# EAGLE design p7ii-001 (EAGLE 9.6.2)
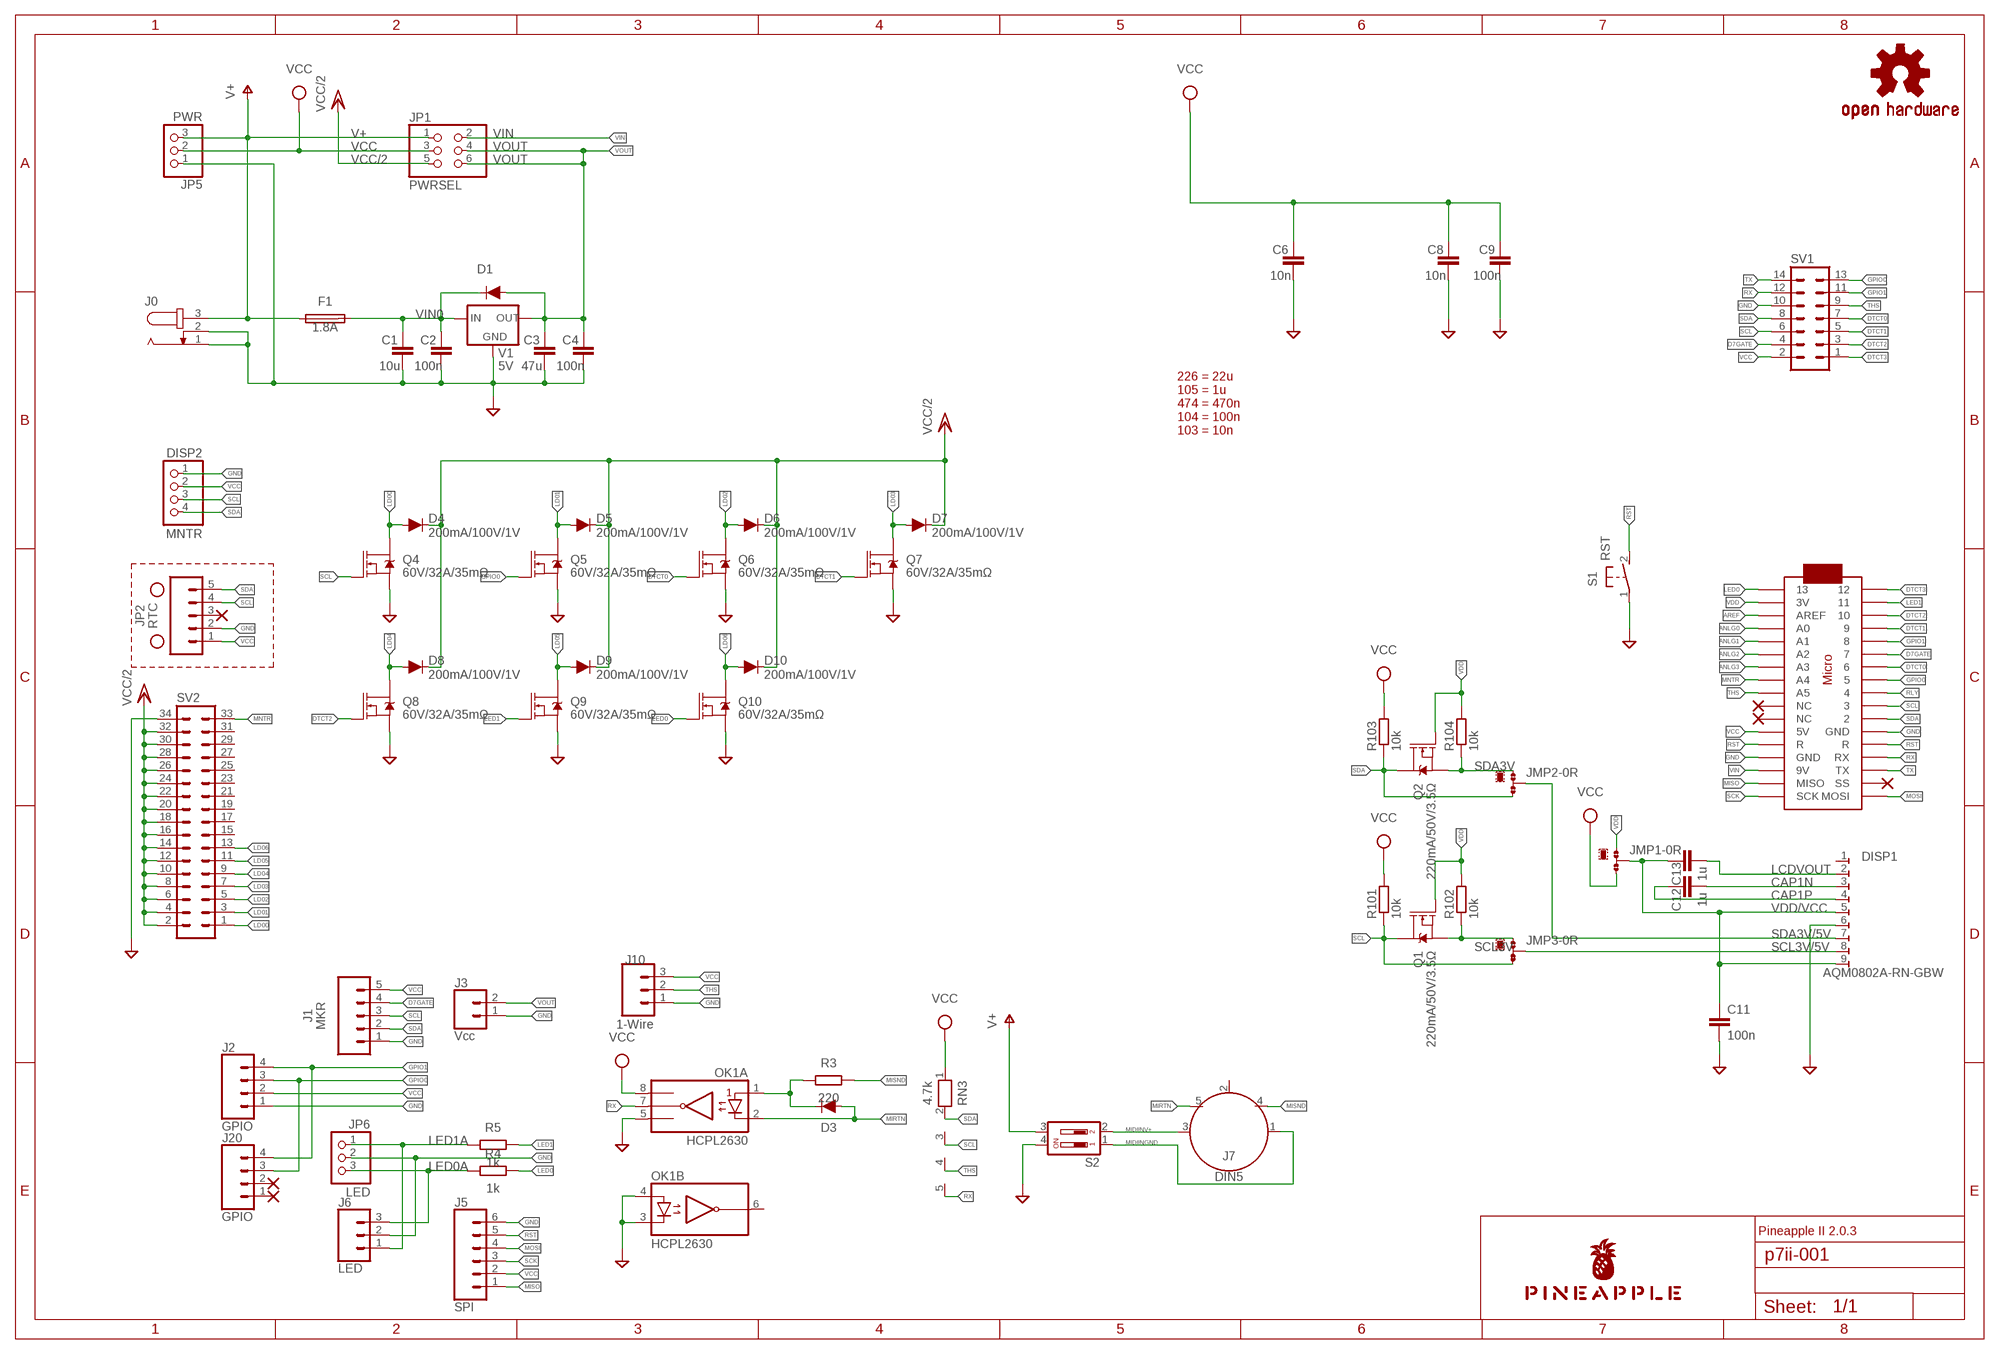
[diagram p0: schematic, sheet 1]

## Parts
C1  10u  C-EU025-030X050  [C025-030X050]
C2  100n  C-EU025-024X044  [C025-024X044]
C3  47u  C-EU025-050X050  [C025-050X050]
C4  100n  C-EU025-024X044  [C025-024X044]
C6  10n  C-EU025-024X044  [C025-024X044]
C8  10n  C-EU025-024X044  [C025-024X044]
C9  100n  C-EU025-024X044  [C025-024X044]
C11  100n  C-EU025-024X044  [C025-024X044]
C12  1u  C-EU050-024X044  [C050-024X044]
C13  1u  C-EU050-024X044  [C050-024X044]
D1  DIODE-1N4148  [DIODE-1N4148]
D3  DIODE-1N4148  [DIODE-1N4148]
D4  200mA/100V/1V  DIODE-1N4148  [DIODE-1N4148]
D5  200mA/100V/1V  DIODE-1N4148  [DIODE-1N4148]
D6  200mA/100V/1V  DIODE-1N4148  [DIODE-1N4148]
D7  200mA/100V/1V  DIODE-1N4148  [DIODE-1N4148]
D8  200mA/100V/1V  DIODE-1N4148  [DIODE-1N4148]
D9  200mA/100V/1V  DIODE-1N4148  [DIODE-1N4148]
D10  200mA/100V/1V  DIODE-1N4148  [DIODE-1N4148]
DISP1  AQM0802A-RN-GBW  [AQM0802A-RN-GBW-FOOTPRINT]
DISP2  MNTR  PINHD-1X4  [1X04]
F1  1.8A  TE5  [TE5]
H1  STAND-OFF  [STAND-OFF]
H2  STAND-OFF  [STAND-OFF]
J0  JACK-PLUG0  [SPC4077]
J1  MKR  CONN_05JST  [JST-5-PTH]
J2  GPIO  CONN_04JST-PTH  [JST-4-PTH]
J3  Vcc  CONN_02JST-PTH-2  [JST-2-PTH]
J5  SPI  CONN_061.27MM  [1X06_1.27MM]
J6  LED  CONN_03JST-PTH-VERT  [JST-3-PTH-VERT]
J7  DIN5  [DIN5-RA-PTH]
J10  1-Wire  CONN_03JST-PTH-VERT  [JST-3-PTH-VERT]
J20  GPIO  CONN_041.27MM  [1X04_1.27MM]
JMP1  0R-JUMPA  [A0R-JMP]
JMP2  0R-JUMPA  [A0R-JMP]
JMP3  0R-JUMPA  [A0R-JMP]
JP1  PWRSEL  PINHD-2X3  [2X03]
JP2  RTC  CONN_05  [1X05]
JP5  PWR  PINHD-1X3  [1X03]
JP6  LED  PINHD-1X3  [1X03]
LOGO1  OSHW-LOGOS-COPPER  [OSHW-LOGO-S_COPPER]
MC1  ARDUINOMICRO  [ARDUINOMICRO]
OK1  HCPL2630  [DIL08]
Q1  220mA/50V/3.5Ω  MOSFET-NCH-BSS138  [SOT23-3]
Q2  220mA/50V/3.5Ω  MOSFET-NCH-BSS138  [SOT23-3]
Q4  60V/32A/35mΩ  MOSFET-NCH-FQP30N06L  [TO220V]
Q5  60V/32A/35mΩ  MOSFET-NCH-FQP30N06L  [TO220V]
Q6  60V/32A/35mΩ  MOSFET-NCH-FQP30N06L  [TO220V]
Q7  60V/32A/35mΩ  MOSFET-NCH-FQP30N06L  [TO220V]
Q8  60V/32A/35mΩ  MOSFET-NCH-FQP30N06L  [TO220V]
Q9  60V/32A/35mΩ  MOSFET-NCH-FQP30N06L  [TO220V]
Q10  60V/32A/35mΩ  MOSFET-NCH-FQP30N06L  [TO220V]
R3  220  R-EU_0204/5  [0204/5]
R4  1k  R-EU_0204/5  [0204/5]
R5  1k  R-EU_0204/5  [0204/5]
R101  10k  R-EU_M2012  [M2012]
R102  10k  R-EU_M2012  [M2012]
R103  10k  R-EU_M2012  [M2012]
R104  10k  R-EU_M2012  [M2012]
RN3  4.7k  RN04  [RN-5]
S1  RST  31-XX  [B3F-31XX]
S2  DIP02YL  [DIP02YL]
SV1  ML14  [ML14]
SV2  ML34L  [ML34L]
U$1  PINEAPPLE450_SILK  [PINEAPPLE450_SILK]
V1  5V  78XXS  [78XXS]

## Nets
ANLG0 [analog]: MC1.P$31(A0)
ANLG1 [analog]: MC1.P$30(A1)
ANLG2 [analog]: MC1.P$29(A2)
ANLG3 [analog]: MC1.P$28(A3)
AREF: MC1.P$32(AREF)
CAP1N: C12.2 DISP1.3
CAP1P: C12.1 DISP1.4
D7GATE: J1.4 MC1.P$6 SV1.4
DTCT0: MC1.P$7 Q6.1(G) SV1.7
DTCT1: MC1.P$4 Q7.1(G) SV1.5
DTCT2: MC1.P$3 Q8.1(G) SV1.3
DTCT3: MC1.P$1 SV1.1
GND [gnd]: C1.2 C2.2 C3.2 C4.2 C6.2 C8.2 C9.2 C11.2 DISP1.6 DISP2.1 J0.1 J0.2 J1.1 J2.1 J3.1 J5.6 J6.2 J10.1 JP2.2 JP5.1 JP6.2 MC1.P$12(GND) MC1.P$21(GND) OK1.3(B:C2) OK1.4(B:A2) OK1.5(A:GND) Q4.3(S) Q5.3(S) Q6.3(S) Q7.3(S) Q8.3(S) Q9.3(S) Q10.3(S) S1.1(P) S2.4 SV1.10 SV2.34 V1.GND
GPIO0: J2.3 J20.3 MC1.P$8 Q5.1(G) SV1.13
GPIO1: J2.4 J20.4 MC1.P$5 SV1.11
LCDVOUT: C13.2 DISP1.2
LD00: D4.A Q4.2(D) SV2.1
LD01: D5.A Q5.2(D) SV2.3
LD02: D6.A Q6.2(D) SV2.5
LD03: D7.A Q7.2(D) SV2.7
LD04: D8.A Q8.2(D) SV2.9
LD05: D9.A Q9.2(D) SV2.11
LD06: D10.A Q10.2(D) SV2.13
LED0: MC1.P$34 Q10.1(G) R4.2
LED0A: J6.3 JP6.3 R4.1
LED1: MC1.P$2 Q9.1(G) R5.2
LED1A: J6.1 JP6.1 R5.1
MIDIINGND [gnd]: J7.1 S2.1
MIDIINSND: D3.C OK1.1(A:A1) R3.1
MIDIINV+ [power]: J7.3 S2.2
MIRTN: D3.A J7.5 OK1.2(A:C1)
MISND: J7.4 R3.2
MISO: J5.1 MC1.P$19(MISO)
MNTR: MC1.P$27(A4) SV2.33
MOSI: J5.4 MC1.P$17(MOSI)
RLY: MC1.P$9
RST: J5.5 MC1.P$13(R) MC1.P$22(R) S1.2(S)
RX: MC1.P$14(RX) OK1.7(A:VO1) RN3.5 SV1.12
SCK: J5.3 MC1.P$18(SCK)
SCL: DISP2.3 J1.3 JMP3.3 JP2.4 MC1.P$10 Q1.3(D) Q4.1(G) R101.1 RN3.3 SV1.6
SCL3V: JMP3.1 Q1.2(S) R102.1
SCL3V/5V: DISP1.8 JMP3.2
SDA: DISP2.4 J1.2 JMP2.3 JP2.5 MC1.P$11 Q2.3(D) R103.1 RN3.2 SV1.8
SDA3V: JMP2.1 Q2.2(S) R104.1
SDA3V/5V: DISP1.7 JMP2.2
THS: J10.2 MC1.P$26(A5) RN3.4 SV1.9
TX: MC1.P$15(TX) SV1.14
V+ [superpower]: F1.1 J0.3 JP1.1 JP5.3 S2.3
VCC [power]: C6.1 C8.1 C9.1 DISP2.2 J1.5 J2.2 J5.2 J10.3 JMP1.3 JP1.3 JP2.1 JP5.2 MC1.P$23(5V) OK1.8(A:VCC) R101.2 R103.2 RN3.1 SV1.2
VCC/2 [superpower]: D4.C D5.C D6.C D7.C D8.C D9.C D10.C JP1.5 SV2.2 SV2.4 SV2.6 SV2.8 SV2.10 SV2.12 SV2.14 SV2.16 SV2.18 SV2.20 SV2.22 SV2.24 SV2.26 SV2.28 SV2.30 SV2.32
VDD [power]: JMP1.1 MC1.P$33(3V) Q1.1(G) Q2.1(G) R102.2 R104.2
VDD/VCC [power]: C11.1 C13.1 DISP1.5 DISP1.9 JMP1.2
VIN [superpower]: JP1.2 MC1.P$20(9V)
VIN0 [superpower]: C1.1 C2.1 D1.C F1.2 V1.IN
VOUT [superpower]: C3.1 C4.1 D1.A J3.2 JP1.4 JP1.6 V1.OUT
Unconnected: DISP1.1 J7.2 J20.1 J20.2 JP2.3 MC1.P$16(SS) MC1.P$24(NC) MC1.P$25(NC) OK1.6(B:VO2) SV2.15 SV2.17 SV2.19 SV2.21 SV2.23 SV2.25 SV2.27 SV2.29 SV2.31

## Notes on the sheet
- 226 = 22u
  105 = 1u
  474 = 470n
  104 = 100n
  103 = 10n
- Pineapple II 2.0.3

## Library data of the parts
C1-C4 C11-C13 = rcl:C-EU: CAPACITOR, European symbol; SPICEPREFIX: C
C6 C8 C9 = resistor:C-EU: CAPACITOR, European symbol
D1 D3 = SparkFun-DiscreteSemi:DIODE: Diode These are standard reverse protection diodes and small signal diodes. SparkFun Products: SparkFun SparkPunk Sound Kit <https://www.sparkfun.com/products/11177> SparkFun ESP8266 Thing <https://www.sparkfun.com/products/13231>; PROD_ID: DIO-08378; VALUE: 200mA/100V/1V
D4-D10 = SparkFun-DiscreteSemi:DIODE: Diode These are standard reverse protection diodes and small signal diodes. SparkFun Products: SparkFun SparkPunk Sound Kit <https://www.sparkfun.com/products/11177> SparkFun ESP8266 Thing <https://www.sparkfun.com/products/13231>; PROD_ID: DIO-08378
DISP1 = AQM0802A-RN-GBW:AQM0802A-RN-GBW: AQM0802A-RN-GBW LCD
DISP2 = pinhead:PINHD-1X4: PIN HEADER
F1 = fuse:TE5: FUSE Wickmann; OC_FARNELL: unknown; OC_NEWARK: unknown
H1 H2 = SparkFun-Hardware:STAND-OFF: Stand Off Drill holes for mechanically mounting via screws, standoffs, etc. Note: Use the keepout ring to avoid running the screw head into surrounding components. Variant Overviews STAND-OFF - Mechanical footprint for a #4 phillips button head screw. STAND-OFF-TIGHT - Mechanical footprint for a #4 phillips button head screw, Example SparkFun Products Screw - Phillips Head (1/4", 4-40, 10 pack) <https://www.sparkfun.com/products/10453> (PRT-10453) Screw - Phillips Head (1/2", 4-40, 10 pack) <https://www.sparkfun.com/products/10452> (PRT-10452) Screw - Phillips Head (3/4", 4-40, 10 pack) <https://www.sparkfun.com/products/10451> (PRT-10451) Screw - Phillips Head (1", 4-40, 10 pack) <https://www.sparkfun.com/products/10450> (PRT-10450)
J0 = con-jack:JACK-PLUG: DC POWER JACK Power Jack, DC, Right Angle, Through Hole, Rated 5A at 16VDC, PC Terminals Distributor: Farnell (www.Farnell.de) Drawing: 84N1161.pdf / 84N1162.pdf Manufacturer: SPC Technology (www.spctechnology.com) Type: SPC4077 / SPC 4078; OC_FARNELL: unknown; OC_NEWARK: unknown
J1 = SparkFun-Connectors:CONN_05: Multi connection point. Often used as Generic Header-pin footprint for 0.1 inch spaced/style header connections On any of the 0.1 inch spaced packages, you can populate with these: Break Away Headers - Straight <https://www.sparkfun.com/products/116> (PRT-00116) Break Away Male Headers - Right Angle <https://www.sparkfun.com/products/553> (PRT-00553) Female Headers <https://www.sparkfun.com/products/115> (PRT-00115) Break Away Headers - Machine Pin <https://www.sparkfun.com/products/117> (PRT-00117) Break Away Female Headers - Swiss Machine Pin <https://www.sparkfun.com/products/743> (PRT-00743) For SCREWTERMINALS and SPRING TERMINALS visit here: Screw Terimnals on SparkFun.com <https://www.sparkfun.com/search/results?term=Screw+Terminals> (5mm/3.5mm/2.54mm spacing) This device is also useful as a general connection point to wire up your design to another part of your project. Our various solder wires solder well into these plated through hole pads. Hook-Up Wire - Assortment (Stranded, 22 AWG) <https://www.sparkfun.com/products/11375> (PRT-11375) Hook-Up Wire - Assortment (Solid Core, 22 AWG) <https://www.sparkfun.com/products/11367> (PRT-11367) View the entire wire category on our website here <https://www.sparkfun.com/categories/141> Special notes: Molex polarized connector foot print use with SKU : PRT-08231 with associated crimp pins and housings. 1MM SMD Version SKU: PRT-10208; SF_ID: PRT-09917
J2 = SparkFun-Connectors:CONN_04: Multi connection point. Often used as Generic Header-pin footprint for 0.1 inch spaced/style header connections On any of the 0.1 inch spaced packages, you can populate with these: Break Away Headers - Straight <https://www.sparkfun.com/products/116> (PRT-00116) Break Away Male Headers - Right Angle <https://www.sparkfun.com/products/553> (PRT-00553) Female Headers <https://www.sparkfun.com/products/115> (PRT-00115) Break Away Headers - Machine Pin <https://www.sparkfun.com/products/117> (PRT-00117) Break Away Female Headers - Swiss Machine Pin <https://www.sparkfun.com/products/743> (PRT-00743) For SCREWTERMINALS and SPRING TERMINALS visit here: Screw Terimnals on SparkFun.com <https://www.sparkfun.com/search/results?term=Screw+Terminals> (5mm/3.5mm/2.54mm spacing) This device is also useful as a general connection point to wire up your design to another part of your project. Our various solder wires solder well into these plated through hole pads. Hook-Up Wire - Assortment (Stranded, 22 AWG) <https://www.sparkfun.com/products/11375> (PRT-11375) Hook-Up Wire - Assortment (Solid Core, 22 AWG) <https://www.sparkfun.com/products/11367> (PRT-11367) View the entire wire category on our website here <https://www.sparkfun.com/categories/141> Special notes: Molex polarized connector foot print use with SKU : PRT-08231 with associated crimp pins and housings. 1MM SMD Version SKU: PRT-10208; PROD_ID: WIRE-13531; SF_ID: PRT-09916
J3 = SparkFun-Connectors:CONN_02: Multi connection point. Often used as Generic Header-pin footprint for 0.1 inch spaced/style header connections On any of the 0.1 inch spaced packages, you can populate with these: Break Away Headers - Straight <https://www.sparkfun.com/products/116> (PRT-00116) Break Away Male Headers - Right Angle <https://www.sparkfun.com/products/553> (PRT-00553) Female Headers <https://www.sparkfun.com/products/115> (PRT-00115) Break Away Headers - Machine Pin <https://www.sparkfun.com/products/117> (PRT-00117) Break Away Female Headers - Swiss Machine Pin <https://www.sparkfun.com/products/743> (PRT-00743) For SCREWTERMINALS and SPRING TERMINALS visit here: Screw Terimnals on SparkFun.com <https://www.sparkfun.com/search/results?term=Screw+Terminals> (5mm/3.5mm/2.54mm spacing) This device is also useful as a general connection point to wire up your design to another part of your project. Our various solder wires solder well into these plated through hole pads. Hook-Up Wire - Assortment (Stranded, 22 AWG) <https://www.sparkfun.com/products/11375> (PRT-11375) Hook-Up Wire - Assortment (Solid Core, 22 AWG) <https://www.sparkfun.com/products/11367> (PRT-11367) View the entire wire category on our website here <https://www.sparkfun.com/categories/141> Special notes: Molex polarized connector foot print use with: PRT-08233 with associated crimp pins and housings. 2.54_SCREWTERM for use with PRT-10571. 3.5mm Screw Terminal footprints for PRT-08084 5mm Screw Terminal footprints for use with PRT-08432; PROD_ID: CONN-09863; SKU: PRT-09914
J5 = SparkFun-Connectors:CONN_06: Multi connection point. Often used as Generic Header-pin footprint for 0.1 inch spaced/style header connections On any of the 0.1 inch spaced packages, you can populate with these: Break Away Headers - Straight <https://www.sparkfun.com/products/116> (PRT-00116) Break Away Male Headers - Right Angle <https://www.sparkfun.com/products/553> (PRT-00553) Female Headers <https://www.sparkfun.com/products/115> (PRT-00115) Break Away Headers - Machine Pin <https://www.sparkfun.com/products/117> (PRT-00117) Break Away Female Headers - Swiss Machine Pin <https://www.sparkfun.com/products/743> (PRT-00743) Arduino Stackable Header - 6 Pin <https://www.sparkfun.com/products/9280> (PRT-09280) For SCREWTERMINALS and SPRING TERMINALS visit here: Screw Terimnals on SparkFun.com <https://www.sparkfun.com/search/results?term=Screw+Terminals> (5mm/3.5mm/2.54mm spacing) This device is also useful as a general connection point to wire up your design to another part of your project. Our various solder wires solder well into these plated through hole pads. Hook-Up Wire - Assortment (Stranded, 22 AWG) <https://www.sparkfun.com/products/11375> (PRT-11375) Hook-Up Wire - Assortment (Solid Core, 22 AWG) <https://www.sparkfun.com/products/11367> (PRT-11367) View the entire wire category on our website here <https://www.sparkfun.com/categories/141>
J6 J10 = SparkFun-Connectors:CONN_03: Multi connection point. Often used as Generic Header-pin footprint for 0.1 inch spaced/style header connections On any of the 0.1 inch spaced packages, you can populate with these: Break Away Headers - Straight <https://www.sparkfun.com/products/116> (PRT-00116) Break Away Male Headers - Right Angle <https://www.sparkfun.com/products/553> (PRT-00553) Female Headers <https://www.sparkfun.com/products/115> (PRT-00115) Break Away Headers - Machine Pin <https://www.sparkfun.com/products/117> (PRT-00117) Break Away Female Headers - Swiss Machine Pin <https://www.sparkfun.com/products/743> (PRT-00743) Stackable Header - 3 Pin (Female, 0.1") <https://www.sparkfun.com/products/13875> (PRT-13875) For SCREWTERMINALS and SPRING TERMINALS visit here: Screw Terimnals on SparkFun.com <https://www.sparkfun.com/search/results?term=Screw+Terminals> (5mm/3.5mm/2.54mm spacing) This device is also useful as a general connection point to wire up your design to another part of your project. Our various solder wires solder well into these plated through hole pads. Hook-Up Wire - Assortment (Stranded, 22 AWG) <https://www.sparkfun.com/products/11375> (PRT-11375) Hook-Up Wire - Assortment (Solid Core, 22 AWG) <https://www.sparkfun.com/products/11367> (PRT-11367) View the entire wire category on our website here <https://www.sparkfun.com/categories/141> Special notes: Molex polarized connector foot print use with SKU : PRT-08232 with associated crimp pins and housings.; PROD_ID: CONN-13230
J7 = SparkFun-Connectors:DIN5: DIN5 Connector - Female Right Angle (frequently used as a MIDI Jack connector) This type of connector and cable is frequently used for transmitting midi data (musical instrument digital interface). It is what you usually see on a keyboard or set of electronic drums. Learn more here <https://en.wikipedia.org/wiki/MIDI>. For more information on the pinout and electrical specifications of MIDI communications, please see the following resource: https://www.midi.org/specifications/item/midi-din-electrical-specification Here is the connector we sell at SparkFun: MIDI Connector - Female Right Angle <https://www.sparkfun.com/products/9536> (PRT-09536) Datasheet <hhttp://www.sparkfun.com/datasheets/Prototyping/Connectors/MIDI-RA.pdf> It is used on this SparkFun product: SparkFun MIDI Shield <https://www.sparkfun.com/products/12898> (DEV-12898); PROD_ID: CONN-09481
J20 = SparkFun-Connectors:CONN_04: Multi connection point. Often used as Generic Header-pin footprint for 0.1 inch spaced/style header connections On any of the 0.1 inch spaced packages, you can populate with these: Break Away Headers - Straight <https://www.sparkfun.com/products/116> (PRT-00116) Break Away Male Headers - Right Angle <https://www.sparkfun.com/products/553> (PRT-00553) Female Headers <https://www.sparkfun.com/products/115> (PRT-00115) Break Away Headers - Machine Pin <https://www.sparkfun.com/products/117> (PRT-00117) Break Away Female Headers - Swiss Machine Pin <https://www.sparkfun.com/products/743> (PRT-00743) For SCREWTERMINALS and SPRING TERMINALS visit here: Screw Terimnals on SparkFun.com <https://www.sparkfun.com/search/results?term=Screw+Terminals> (5mm/3.5mm/2.54mm spacing) This device is also useful as a general connection point to wire up your design to another part of your project. Our various solder wires solder well into these plated through hole pads. Hook-Up Wire - Assortment (Stranded, 22 AWG) <https://www.sparkfun.com/products/11375> (PRT-11375) Hook-Up Wire - Assortment (Solid Core, 22 AWG) <https://www.sparkfun.com/products/11367> (PRT-11367) View the entire wire category on our website here <https://www.sparkfun.com/categories/141> Special notes: Molex polarized connector foot print use with SKU : PRT-08231 with associated crimp pins and housings. 1MM SMD Version SKU: PRT-10208
JMP1-JMP3 = jump-0r-smd:0R-JUMP: SMD 0R 0805 Jumper
JP1 = pinhead:PINHD-2X3: PIN HEADER
JP2 = SparkFun-Connectors:CONN_05: Multi connection point. Often used as Generic Header-pin footprint for 0.1 inch spaced/style header connections On any of the 0.1 inch spaced packages, you can populate with these: Break Away Headers - Straight <https://www.sparkfun.com/products/116> (PRT-00116) Break Away Male Headers - Right Angle <https://www.sparkfun.com/products/553> (PRT-00553) Female Headers <https://www.sparkfun.com/products/115> (PRT-00115) Break Away Headers - Machine Pin <https://www.sparkfun.com/products/117> (PRT-00117) Break Away Female Headers - Swiss Machine Pin <https://www.sparkfun.com/products/743> (PRT-00743) For SCREWTERMINALS and SPRING TERMINALS visit here: Screw Terimnals on SparkFun.com <https://www.sparkfun.com/search/results?term=Screw+Terminals> (5mm/3.5mm/2.54mm spacing) This device is also useful as a general connection point to wire up your design to another part of your project. Our various solder wires solder well into these plated through hole pads. Hook-Up Wire - Assortment (Stranded, 22 AWG) <https://www.sparkfun.com/products/11375> (PRT-11375) Hook-Up Wire - Assortment (Solid Core, 22 AWG) <https://www.sparkfun.com/products/11367> (PRT-11367) View the entire wire category on our website here <https://www.sparkfun.com/categories/141> Special notes: Molex polarized connector foot print use with SKU : PRT-08231 with associated crimp pins and housings. 1MM SMD Version SKU: PRT-10208
JP5 JP6 = pinhead:PINHD-1X3: PIN HEADER
LOGO1 = SparkFun-Aesthetics:OSHW-LOGO: Open-Source Hardware (OSHW) Logo This logo indicates the piece of hardware it is found on incorporates a OSHW license and/or adheres to the definition of open source hardware found here: http://freedomdefined.org/OSHW
MC1 = adafruit:ARDUINOMICRO
OK1 = optocoupler:HCPL2630: HEWLETT PACKARD OPTO COUPLER; MF: AGILENT TECHNOLOGIES; MPN: HCPL-2630-000E; OC_FARNELL: 9994904; OC_NEWARK: 88H7813
Q1 Q2 = SparkFun-DiscreteSemi:MOSFET-NCH: N-channel MOSFETs Voltage controlled devices that allow control of high current outputs. SparkFun Products: SparkFun OpenScale <https://www.sparkfun.com/products/13261> SparkFun Digital Sandbox <https://www.sparkfun.com/products/12651> SparkFun Monster Moto Shield <https://www.sparkfun.com/products/10182> SparkFun MOSFET Power Controller <https://www.sparkfun.com/products/11214>; PROD_ID: TRANS-00830
Q4-Q10 = SparkFun-DiscreteSemi:MOSFET-NCH: N-channel MOSFETs Voltage controlled devices that allow control of high current outputs. SparkFun Products: SparkFun OpenScale <https://www.sparkfun.com/products/13261> SparkFun Digital Sandbox <https://www.sparkfun.com/products/12651> SparkFun Monster Moto Shield <https://www.sparkfun.com/products/10182> SparkFun MOSFET Power Controller <https://www.sparkfun.com/products/11214>; PROD_ID: TRANS-10060
R3-R5 = resistor:R-EU_: RESISTOR, European symbol
R101-R104 = rcl:R-EU_: RESISTOR, European symbol; SPICEPREFIX: R
RN3 = resistor-net:RN04: RESISTOR NETWORK; OC_FARNELL: unknown; OC_NEWARK: unknown
S1 = switch-omron:31-XX: OMRON SWITCH; MPN: B3F-3100; OC_FARNELL: 959704; OC_NEWARK: 36M3582
S2 = switch-dil:DIP02YL: DIL/CODE SWITCH; OC_FARNELL: unknown; OC_NEWARK: unknown
SV1 = con-ml:ML14: HARTING; OC_FARNELL: unknown; OC_NEWARK: unknown
SV2 = con-ml:ML34L: HARTING; OC_FARNELL: unknown; OC_NEWARK: unknown
U$1 = pineapple:PINEAPPLE450_SILK
V1 = v-reg:78XXS: VOLTAGE REGULATOR

## Net classes
0 default: width 0.152 mm, drill 0.152 mm, clearance 0.152 mm
1 gnd: width 0.305 mm, drill 0.152 mm, clearance 0.152 mm
2 power: width 0.508 mm, drill 0.152 mm, clearance 0.152 mm
3 analog: width 0.305 mm, drill 0.152 mm, clearance 0.152 mm
4 superpower: width 1.016 mm, drill 0.152 mm, clearance 0.152 mm

## Board
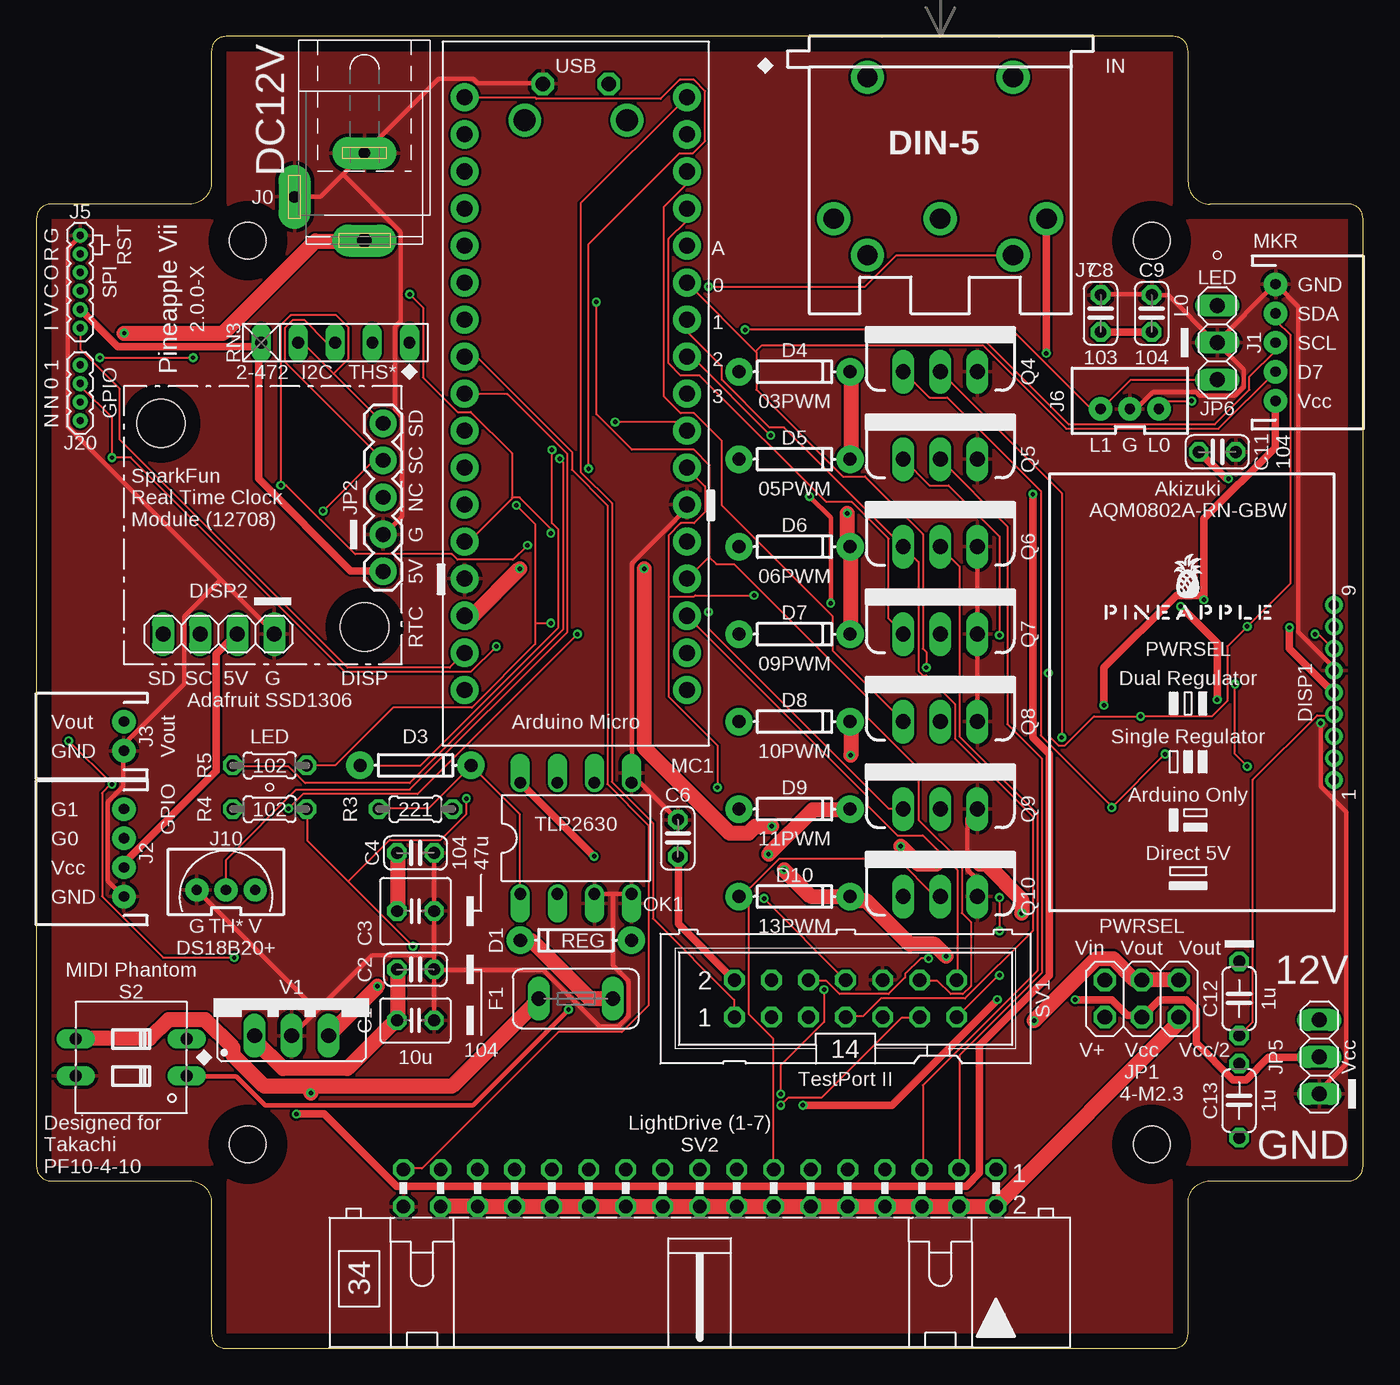
[diagram p1: board, top side]
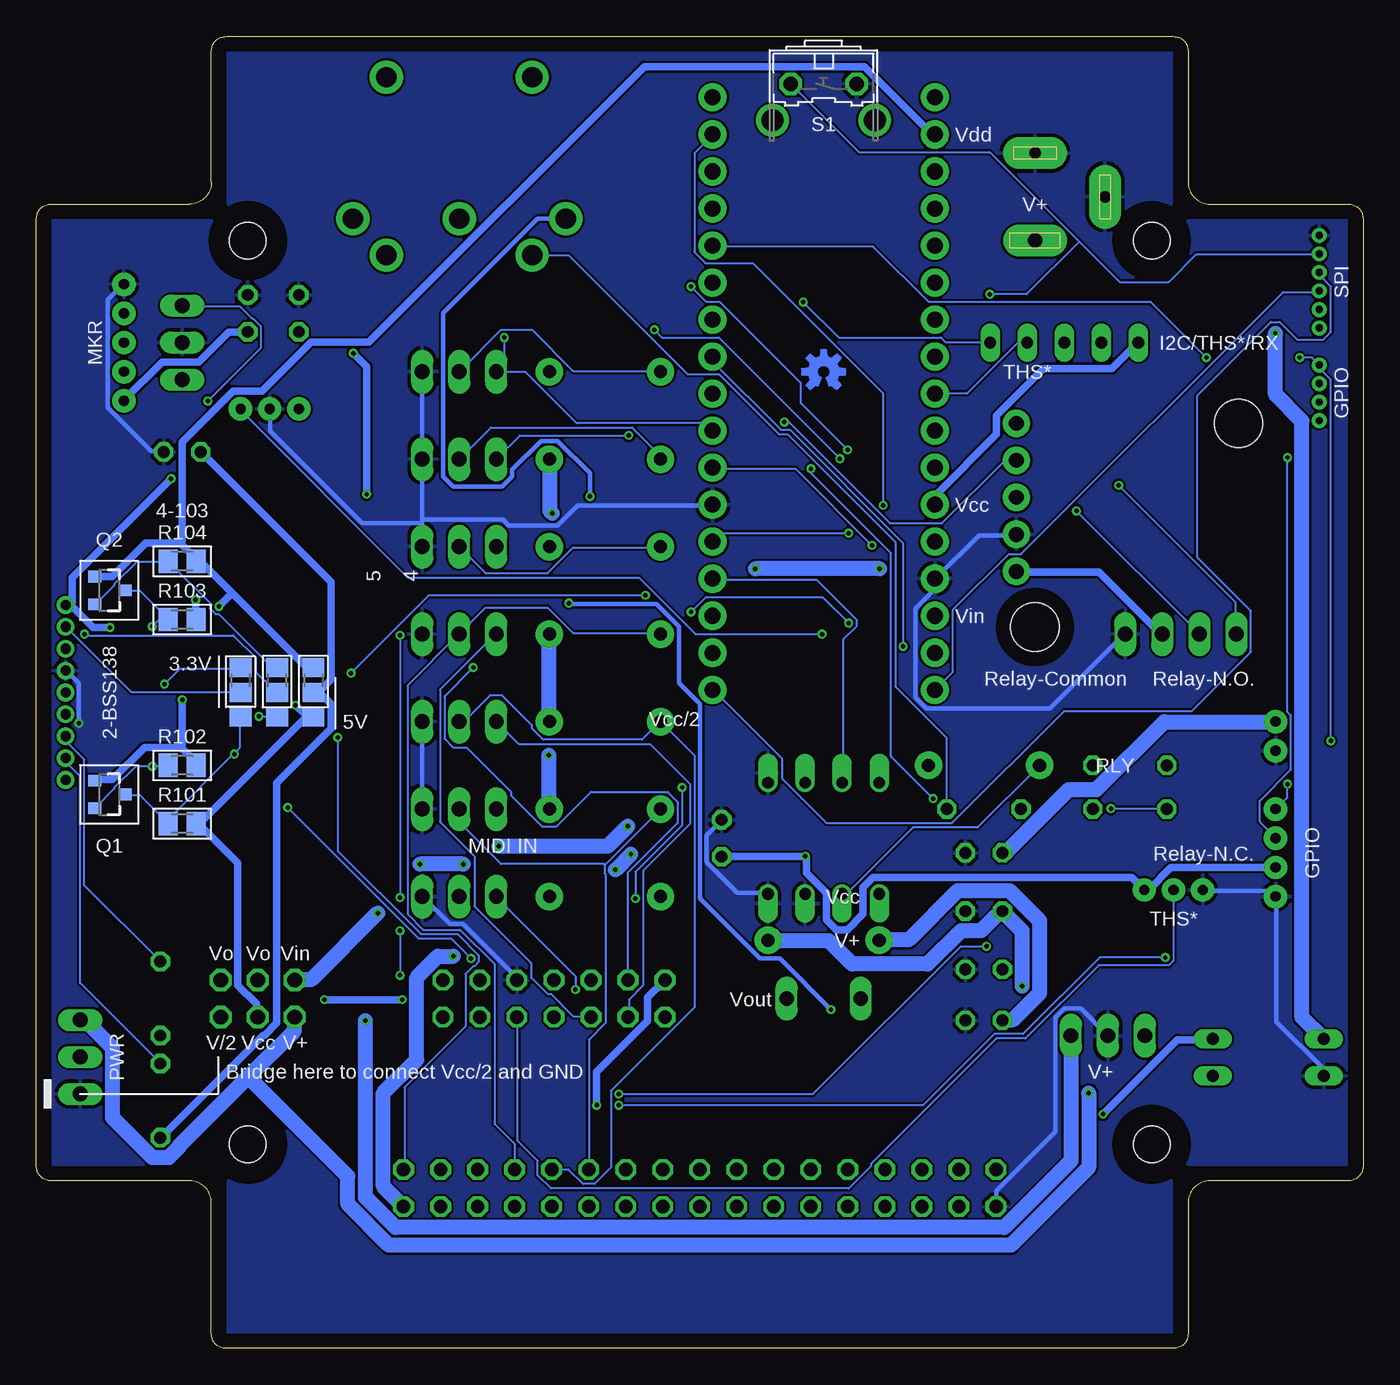
[diagram p2: board, bottom side, seen from below]

Size 91 x 90 mm. Coordinates in mm from the lower left corner, seen from the top.
Outline: 78,90 13,90 arc90 12,89 12,80 arc-90 10.5,78.5 1,78.5 arc90 0,77.5 0,12.5 arc90 1,11.5 10.5,11.5 arc-90 12,10 12,1 arc90 13,0 78,0 arc90 79,1 79,10 arc-90 80.5,11.5 90,11.5 arc90 91,12.5 91,77.5 arc90 90,78.5 80.5,78.5 arc-90 79,80 79,89 arc90 78,90
Copper layers (1*16): Top 0.035mm / dielectric 1.5mm / Bottom 0.035mm
Design rules "SeeedStudio_2layer_DRU_no_angle_20140221": minimum track width 6mil, minimum drill 12mil, track to track 6mil, track to pad 6mil, pad to pad 6mil, via to via 6mil, smd to smd 0mil, copper to edge 10mil, drill to drill 10mil, minimum pad ring 10mil, minimum via ring 6mil, stop-mask expansion 2mil, vias tented up to drill 100mil, thermal gap 10mil
Holes 2.5 mm at 76.5,76 14.5,76 14.5,14 76.5,14
tRestrict: area 11.9,73.4 to 17.1,78.6; area 73.9,73.4 to 79.1,78.6; area 11.9,11.4 to 17.1,16.6; area 73.9,11.4 to 79.1,16.6; area 12,89 to 79,90; area 90,11.5 to 91,78.5; area 12,0 to 79,1; area 0,11.5 to 1,78.5; area 0,77.5 to 12,78.5; area 12,78.5 to 13,90; area 78,78.5 to 79,90; area 79,77.5 to 91,78.5; 10 more areas
bRestrict: area 11.9,11.4 to 17.1,16.6; area 73.9,11.4 to 79.1,16.6; area 73.9,73.4 to 79.1,78.6; area 11.9,73.4 to 17.1,78.6; area 78,0 to 79,11.5; area 79,11.5 to 91,12.5; area 90,11.5 to 91,78.5; area 79,77.5 to 91,78.5; area 78,78.5 to 79,90; area 12,89 to 79,90; area 12,78.5 to 13,90; area 0,77.5 to 12,78.5; 10 more areas

### Footprints (pad centres in the part's own frame; a part is rotated, then mirrored left to right if it is on the bottom)
C025-030X050 = drill 0.813 octagon: 1 -1.27,0; 2 1.27,0
C025-024X044 = drill 0.813 octagon: 1 -1.27,0; 2 1.27,0
C025-050X050 = drill 0.813 octagon: 1 -1.27,0; 2 1.27,0
C050-024X044 = drill 0.813 octagon: 1 -2.54,0; 2 2.54,0
DIODE-1N4148 = drill 0.9 pad 1.88: A -3.81,0; C 3.81,0
AQM0802A-RN-GBW-FOOTPRINT = drill 0.7 pad 1: 1 -6,0; 2 -4.5,0; 3 -3,0; 4 -1.5,0; 5 0,0; 6 1.5,0; 7 3,0; 8 4.5,0; 9 6,0
1X04 = drill 1.016 long: 1 -3.81,0; 2 -1.27,0; 3 1.27,0; 4 3.81,0
TE5 = drill 1.016 long: 1 -2.54,0; 2 2.54,0
STAND-OFF = hole 3.302: 0,0
SPC4077 = drill 0.8 pad 2.184 long: 1 -3,0; 2 0,-4.8 | drill 1 pad 2.184 long: 3 3,0
JST-5-PTH = drill 0.7 pad 1.6: 1 -4,0; 2 -2,0; 3 0,0; 4 2,0; 5 4,0
JST-4-PTH = drill 0.7 pad 1.6: 1 -3,0; 2 -1,0; 3 1,0; 4 3,0
JST-2-PTH = drill 0.7 pad 1.6: 1 -1,0; 2 1,0
1X06_1.27MM = drill 0.508 pad 1: 1 0,0; 2 1.27,0; 3 2.54,0; 4 3.81,0; 5 5.08,0; 6 6.35,0
JST-3-PTH-VERT = drill 0.7 pad 1.6: 1 -2,-0.55; 2 0,-0.55; 3 2,-0.55
DIN5-RA-PTH = drill 1.4 pad 2.286: 1 7.3,12.5; 2 0,12.5; 3 -7.3,12.5; 4 5,15; 5 -5,15; 6 -5,2.8; 7 5,2.8
1X04_1.27MM = drill 0.508 pad 1: 1 0,0; 2 1.27,0; 3 2.54,0; 4 3.81,0
A0R-JMP = smd 1.5 x 1.3: 1 0,1.7; 2 0,0; 3 0,-1.7
2X03 = drill 1.016 octagon: 1 -2.54,-1.27; 2 -2.54,1.27; 3 0,-1.27; 4 0,1.27; 5 2.54,-1.27; 6 2.54,1.27
1X05 = drill 1.016 pad 1.88: 1 0,0; 2 2.54,0; 3 5.08,0; 4 7.62,0; 5 10.16,0
1X03 = drill 1.016 long: 1 -2.54,0; 2 0,0; 3 2.54,0
ARDUINOMICRO = drill 1.1 pad 1.93: P$1 -20.32,7.62; P$2 -17.78,7.62; P$3 -15.24,7.62; P$4 -12.7,7.62; P$5 -10.16,7.62; P$6 -7.62,7.62; P$7 -5.08,7.62; P$8 -2.54,7.62; P$9 0,7.62; P$10 2.54,7.62; P$11 5.08,7.62; P$12 12.7,-7.62; P$13 10.16,-7.62; P$14 12.7,7.62; P$15 15.24,7.62; P$16 17.78,7.62; P$17 20.32,7.62; P$18 20.32,-7.62; P$19 17.78,-7.62; P$20 15.24,-7.62; P$21 7.62,7.62; P$22 10.16,7.62; P$23 7.62,-7.62; P$24 5.08,-7.62; P$25 2.54,-7.62; P$26 0,-7.62; P$27 -2.54,-7.62; P$28 -5.08,-7.62; P$29 -7.62,-7.62; P$30 -10.16,-7.62; P$31 -12.7,-7.62; P$32 -15.24,-7.62; P$33 -17.78,-7.62; P$34 -20.32,-7.62
DIL08 = drill 0.813 offset: 1 -3.81,-3.81; 2 -1.27,-3.81; 3 1.27,-3.81; 4 3.81,-3.81; 5 3.81,3.81; 6 1.27,3.81; 7 -1.27,3.81; 8 -3.81,3.81
SOT23-3 = smd 0.8 x 0.9: 1 -0.95,-1; 2 0.95,-1; 3 0,1.1
TO220V = drill 1.016 long: 1 -2.54,0; 2 0,0; 3 2.54,0
0204/5 = drill 0.813 octagon: 1 -2.54,0; 2 2.54,0
M2012 = smd 1.3 x 1.6: 1 -0.95,0; 2 0.95,0
RN-5 = drill 0.813 long: 1 -5.08,0; 2 -2.54,0; 3 0,0; 4 2.54,0; 5 5.08,0
B3F-31XX = drill 1.016 octagon: 1 -2.261,-1.245; 2 2.261,-1.245 | drill 1.499 pad 2.159: 3 -3.505,1.245; 4 3.505,1.245
DIP02YL = drill 0.813 long: 1 -1.27,-3.81; 2 1.27,-3.81; 3 1.27,3.81; 4 -1.27,3.81
ML14 = drill 0.914 octagon: 1 -7.62,-1.27; 2 -7.62,1.27; 3 -5.08,-1.27; 4 -5.08,1.27; 5 -2.54,-1.27; 6 -2.54,1.27; 7 0,-1.27; 8 0,1.27; 9 2.54,-1.27; 10 2.54,1.27; 11 5.08,-1.27; 12 5.08,1.27; 13 7.62,-1.27; 14 7.62,1.27
ML34L = drill 0.914 octagon: 1 -20.32,-1.27; 2 -20.32,1.27; 3 -17.78,-1.27; 4 -17.78,1.27; 5 -15.24,-1.27; 6 -15.24,1.27; 7 -12.7,-1.27; 8 -12.7,1.27; 9 -10.16,-1.27; 10 -10.16,1.27; 11 -7.62,-1.27; 12 -7.62,1.27; 13 -5.08,-1.27; 14 -5.08,1.27; 15 -2.54,-1.27; 16 -2.54,1.27; 17 0,-1.27; 18 0,1.27; 19 2.54,-1.27; 20 2.54,1.27; 21 5.08,-1.27; 22 5.08,1.27; 23 7.62,-1.27; 24 7.62,1.27; 25 10.16,-1.27; 26 10.16,1.27; 27 12.7,-1.27; 28 12.7,1.27; 29 15.24,-1.27; 30 15.24,1.27; 31 17.78,-1.27; 32 17.78,1.27; 33 20.32,-1.27; 34 20.32,1.27
78XXS = drill 1.016 long: GND 0,-2.54; IN -2.54,-2.54; OUT 2.54,-2.54

### Placement (x,y rotation side)
C1  26,22.5 0 top
C2  26,26 0 top
C3  26,30 0 top
C4  26,34 0 top
C6  44,35 90 top
C8  73,71 90 top
C9  76.5,71 90 top
C11  81,61.5 0 top
C12  82.5,24 90 top
C13  82.5,17 90 top
D1  37,28 180 top
D3  26,40 0 top
D4  52,67 0 top
D5  52,61 0 top
D6  52,55 0 top
D7  52,49 0 top
D8  52,43 0 top
D9  52,37 0 top
D10  52,31 0 top
DISP1  89,45 90 top
DISP2  12.5,49 180 top
F1  37,24 0 top
H1  22.51,49.49 0 top
H2  8.54,63.46 0 top
J0  22.5,79 270 top
J1  85,69 270 top
J2  6,34 90 top
J3  6,42 90 top
J5  3,70 90 top
J6  75,65 0 top
J7  62,90 180 top
J10  13,32 0 top
J20  3,63.65 90 top
JMP1  72,45 0 bottom
JMP2  74.5,45 0 bottom
JMP3  77,45 0 bottom
JP1  75.82,24 0 top
JP2  23.78,53.3 90 top
JP5  88,20 90 top
JP6  81,69 90 top
LOGO1  37,67 0 bottom
MC1  37,65.5 270 top
OK1  37,35 0 top
Q1  86,38 270 bottom
Q2  86,52 270 bottom
Q4  62,67 0 top
Q5  62,61 0 top
Q6  62,55 0 top
Q7  62,49 0 top
Q8  62,43 0 top
Q9  62,37 0 top
Q10  62,31 0 top
R3  26,37 0 top
R4  16,37 0 top
R5  16,40 0 top
R101  81,36 0 bottom
R102  81,40 0 bottom
R103  81,50 0 bottom
R104  81,54 0 bottom
RN3  20.5,69 0 top
S1  37,85.5 180 bottom
S2  6.5,19.96 90 top
SV1  55.5,24 0 top
SV2  45.5,11 180 top
U$1  79,50 0 top
V1  17.5,24 0 top

### Tracks (layer width: path | path; a pad name or v marks a point on that pad's centre or on a via)
CAP1N
  Bottom 0.152: DISP1.3 88.92,41.99 88.92,41.6 87.71,40.39 87.71,31.77 82.53,26.59 C12.2
CAP1P
  Top 0.152: DISP1.4 88.92,43.43 87.86,43.43 83.44,39.01 83.44,22.4 82.53,21.49 C12.1
D7GATE  (via drill 0.3)
  Top 0.152: v61.04,46.71 61.04,47.78 60.81,48.01 60.81,55.85 56.84,59.82 55.32,59.82 49.38,65.76 49.38,68.35 49.34,68.39 | 49.34,68.39 44.65,73.08 MC1.P$6 | 49.34,68.39 49.76,68.81 64.92,68.81 70.64,63.09 81.08,63.09 84.96,66.98 J1.4
  Bottom 0.152: v61.04,46.71 63.02,44.73 63.02,41.83 62.41,41.22 61.49,41.22 58.45,38.18 58.45,37.95 56.31,35.81 55.32,35.81 52.96,38.18 47.7,38.18 47.02,37.49 47.02,36.04 50.44,32.61 50.44,25.3 SV1.4
DTCT0
  Top 0.152: SV1.7 55.55,22.78 56.69,22.78 57.91,24 63.7,24 68.35,28.65 68.35,36.5 63.02,41.83 63.02,44.2 61.04,46.18 60.81,46.18 60.5,46.48 60.5,53.95 59.51,54.94 Q6.1 59.44,55.02 51.28,63.17 50.29,63.17 47.02,66.45 47.02,67.36 44.65,69.72 44.65,70.56 MC1.P$7
DTCT1
  Top 0.152: MC1.P$4 44.58,78.18 44.58,77.34 43.36,76.12 43.36,67.59 44.2,66.75 45.49,66.75 54.18,58.06 55.93,58.06 58.45,55.55 58.45,50.06 59.44,49.07 Q7.1
  Bottom 0.152: SV1.5 53.03,22.78 54.18,22.78 55.7,24.31 55.93,24.31 57.07,25.45 57.07,26.44 60.96,30.33 60.96,33.76 63.32,36.12 63.32,45.19 59.51,49 Q7.1
DTCT2
  Top 0.152: MC1.P$3 44.58,80.7 44.58,79.86 43.05,78.33 43.05,65.3 44.2,64.16 45.11,64.16 47.02,62.26 47.02,57.84 54.63,50.22 54.63,47.85 59.44,43.05 Q8.1
  Bottom 0.152: SV1.3 50.37,22.78 50.37,23.93 49.38,24.92 49.38,32.77 46.18,35.97 46.18,38.71 48.92,41.45 57.91,41.45 59.44,42.98 Q8.1
DTCT3
  Top 0.152: SV1.1 47.85,22.78 47.85,23.93 42.29,29.49 42.29,36.04 39.47,38.86 39.47,57.99 37.34,60.12 37.34,78.56 44.58,85.8 MC1.P$1
GND  (via drill 0.3)
  Top 0.305: 39.55,31.17 40.77,31.17 OK1.4 | 39.55,31.17 38.33,31.17 OK1.3 | C6.2 43.97,36.27 41.45,38.79 40.84,38.79 OK1.5 40.84,38.94 40.84,53.87 44.58,57.61 44.58,57.84 MC1.P$21 | Q6.3 64.54,54.94 64.54,49.07 Q7.3 64.54,48.92 64.54,43.05 Q8.3 | Q10.3 64.47,31.01 64.47,32.23 63.86,32.84 63.86,36.35 64.47,36.96 Q9.3 | C8.2 73.08,72.31 76.43,72.31 C9.2 76.66,72.24 77.65,72.24 80.85,69.04 JP6.2 | DISP1.6 88.92,46.56 88.92,46.79 86.56,49.15 86.56,71.48 85.04,73 J1.1 84.89,72.92 81,69.04 JP6.2 | v88.09,42.9 88.09,38.56 89.84,36.8 89.84,19.51 88.01,17.68 88.01,17.53 JP5.1 | J6.2 75.06,64.47 75.44,64.47 76.58,65.61 79.55,65.61 79.78,65.38 82.22,65.38 82.83,65.99 82.83,67.13 81.08,68.89 JP6.2 | J2.1 5.94,31.01 4.88,32.08 4.88,37.49 5.94,38.56 5.94,41 J3.1 6.02,41.15 6.02,41.45 10.13,45.57 10.13,50.22 12.65,52.73 | C1.2 27.28,22.55 27.28,25.98 C2.2 | 27.28,26.98 27.28,26.14 C2.2 | 27.28,26.98 27.28,29.95 C3.2 27.28,30.1 27.28,33.98 C4.2 | 27.28,26.98 23.01,26.98 19.24,23.2 | 19.24,23.2 17.53,21.49 V1.GND | 19.24,23.2 11.05,31.39 J10.1 | S1.1 34.67,86.79 30.25,86.79 29.95,87.1 27.58,87.1 22.55,82.07 J0.1 22.4,81.92 21.03,80.54 | 21.03,80.54 19.51,79.02 17.75,79.02 J0.2 | 12.65,52.73 16.31,49.07 DISP2.1 | 12.65,52.73 2.13,63.25 2.13,75.44 2.97,76.28 J5.6 | 21.03,80.54 24.99,76.58 24.99,70.48 24.61,70.1 24.61,64.39 25.07,63.93 25.07,57.07 23.85,55.85 JP2.2 | 39.55,31.17 39.55,26.29 40.62,25.22 40.62,22.78 39.93,22.1 38.63,22.1 34.75,25.98 27.43,25.98 C2.2
  Bottom 0.305: OK1.4 40.84,31.24 42.9,31.24 45.03,33.38 45.03,35.2 44.04,36.2 C6.2 | SV1.10 58.06,25.3 58.06,25.45 61.72,29.11 62.64,29.11 64.47,30.94 Q10.3 | Q4.3 64.54,66.98 64.54,61.04 Q5.3 64.54,60.88 64.54,56.84 | Q9.3 64.54,37.03 64.54,42.98 Q8.3 | 64.54,56.62 64.54,55.02 Q6.3 | 64.54,56.62 64.54,56.84 | 64.54,56.84 58.98,56.84 58.6,56.46 55.24,56.46 53.87,57.84 44.65,57.84 MC1.P$21 | C11.2 82.3,61.57 83.13,61.57 86.11,64.54 86.11,71.93 85.04,73 J1.1 | v88.09,42.9 88.09,45.64 88.92,46.48 DISP1.6 | 64.54,56.62 68.66,56.62 74.98,62.94 74.98,64.39 J6.2 | S2.4 2.74,18.75 2.74,19.2 5.94,22.4 5.94,30.94 J2.1 6.1,31.09 6.4,31.39 10.97,31.39 J10.1 | SV2.34 25.15,9.75 25.15,10.82 21.11,14.86 21.11,22.71 20.5,23.32 19.36,23.32 17.53,21.49 V1.GND | JP2.2 23.85,55.78 26.36,55.78 29.34,52.81 MC1.P$12 29.41,52.65 29.41,52.05 30.71,50.75 30.71,44.65 29.95,43.89 21.49,43.89 16.38,49 DISP2.1
  pour Top: -1,-1 92,-1 92,91 -1,91
  pour Bottom: -2,-2 93,-2 93,92 -2,92
GPIO0  (via drill 0.3)
  Top 0.152: J20.3 3.05,66.14 3.05,65.99 5.18,63.86 v5.18,61.11 6.48,61.11 21.18,46.41 29.79,46.41 v31.55,48.16 | v66.06,25.6 65.99,25.6 63.17,22.78 SV1.13 | v66.06,30.94 v66.06,28.65 | v66.06,48.92 66.06,55.7 62.56,59.21 61.27,59.21 59.51,60.96 Q5.1 | v50.37,62.64 45.03,67.97 44.65,67.97 MC1.P$8
  Bottom 0.152: v5.18,61.11 5.18,43.66 4.95,43.43 4.95,39.7 7.09,37.57 7.09,36.12 6.02,35.05 J2.3 | v66.06,28.65 v66.06,25.6 | v66.06,48.92 v66.06,30.94 | v50.37,62.64 57.84,62.64 59.44,61.04 Q5.1 | v31.55,48.16 31.55,55.24 39.32,63.02 39.93,63.02 44.58,67.67 44.58,67.97 MC1.P$8
GPIO1  (via drill 0.3)
  Top 0.152: v2.21,41.68 v5.18,38.71 5.11,38.71 4.5,38.1 4.5,31.01 8.69,26.82 v13.56,26.82 | v51.05,16.69 51.59,17.22 53.87,17.22 59.36,22.71 60.58,22.71 SV1.11 | v4.34,67.97 v10.74,67.97
  Bottom 0.152: v2.21,41.68 2.21,66.45 2.97,67.21 2.97,67.44 J20.4 3.05,67.51 3.5,67.97 v4.34,67.97 | v5.18,38.71 5.18,37.8 5.94,37.03 J2.4 | v51.05,16.69 30.18,16.69 25.3,21.57 23.32,21.57 18.06,26.82 v13.56,26.82 | v10.74,67.97 14.55,71.78 29.79,71.78 33.6,75.59 44.58,75.59 MC1.P$5
LCDVOUT
  Bottom 0.152: DISP1.2 88.92,40.46 88.92,40.16 88.01,39.24 88.01,25.07 82.53,19.58 C13.2
LD00  (via drill 0.3)
  Top 0.152: v70.33,41.91 70.33,58.67 62.03,66.98 Q4.2
  Bottom 0.152: v70.33,41.91 70.33,34.14 64.62,28.42 62.1,28.42 60.66,26.98 60.66,26.52 60.96,26.21 61.04,26.21 61.57,25.68 61.57,22.1 65.76,17.91 65.76,12.34 SV2.1 | D4.A 48.23,67.06 54.18,67.06 57,69.88 59.13,69.88 61.95,67.06 Q4.2
LD01
  Top 0.152: SV2.3 63.32,12.34 63.32,20.12 68.96,25.76 68.96,40.46 66.6,42.82 66.6,56.39 62.03,60.96 Q5.2
  Bottom 0.152: D5.A 48.23,61.04 48.23,61.27 50.14,63.17 59.82,63.17 61.95,61.04 Q5.2
LD02
  Top 0.152: SV2.5 60.81,12.34 60.81,18.06 68.66,25.91 68.66,36.65 63.32,41.99 63.32,53.65 62.03,54.94 Q6.2
  Bottom 0.152: D6.A 48.23,54.94 54.18,54.94 55.93,53.19 60.2,53.19 61.95,54.94 Q6.2
LD03
  Bottom 0.152: SV2.7 58.22,12.34 58.22,14.02 59.59,15.39 59.59,26.36 61.95,28.73 64.47,28.73 65.53,29.79 65.53,45.49 62.03,49 Q7.2 61.95,49.07 60.2,50.83 55.93,50.83 54.18,49.07 48.23,49.07 D7.A
LD04
  Bottom 0.152: SV2.9 55.63,12.27 54.48,12.27 53.49,11.28 52.73,11.28 51.59,12.42 51.59,17.68 45.87,23.39 45.87,40.69 48.16,42.98 D8.A 48.23,42.98 49.45,41.76 56.24,41.76 57,42.52 57,42.75 59.05,44.81 59.89,44.81 61.65,43.05 61.95,43.05 Q8.2
LD05
  Bottom 0.152: 52.01,33.19 48.23,36.96 D9.A | 52.01,33.19 52.05,33.15 52.05,32.61 51.97,32.54 51.97,22.33 53.11,21.18 53.11,12.34 SV2.11 | Q9.2 61.95,36.96 61.95,36.04 59.13,33.22 52.05,33.22 52.01,33.19
LD06
  Top 0.152: SV2.13 50.52,12.34 50.52,21.26 48.84,22.94 48.84,30.33 48.23,30.94 D10.A 48.31,30.94 50.98,33.6 59.05,33.6 61.65,31.01 61.95,31.01 Q10.2
LED0  (via drill 0.3)
  Top 0.152: v25.83,27.58 21.37,32.04 | 21.37,32.04 18.59,34.82 18.59,36.96 R4.2 | v51.05,17.45 51.05,19.43 54.03,22.4 v54.03,24.61 | v37.87,60.35 37.87,75.74 44.12,81.99 45.03,81.99 45.87,82.83 45.87,86.26 45.11,87.02 44.12,87.02 42.82,85.72 34.29,85.72 34.21,85.8 29.41,85.8 MC1.P$34 | v29.49,37.72 29.49,36.65 27.74,34.9 24.23,34.9 21.37,32.04
  Bottom 0.152: v25.83,27.58 27.58,27.58 37.72,17.45 v51.05,17.45 | v54.03,24.61 54.03,25.53 59.44,30.94 Q10.1 | v37.87,60.35 37.87,60.05 32.38,54.56 32.38,40.62 v29.49,37.72
LED0A  (via drill 0.3)
  Top 0.152: v17.3,37.03 18.29,38.02 26.14,38.02 v37.11,49 | v79.25,65 77.57,65 77.04,64.47 J6.3
  Bottom 0.152: v17.3,37.03 13.49,37.03 R4.1 | v37.11,49 45.8,49 49.68,52.88 65.53,52.88 77.04,64.39 J6.3 | v79.25,65 75.59,68.66 75.59,70.1 76.12,70.64 76.2,70.64 77.04,71.48 80.92,71.48 JP6.3
LED1  (via drill 0.3)
  Top 0.152: 34.21,49.76 34.21,56.54 v32.92,57.84 | 34.21,49.76 34.21,48.31 29.87,43.97 24.46,43.97 20.5,40.01 18.59,40.01 R5.2 | v46.1,50.52 46.1,49.38 58.45,37.03 59.44,37.03 Q9.1 | 34.21,49.76 v35.28,49.76
  Bottom 0.152: v32.92,57.84 32.92,65.53 41.83,74.45 45.11,74.45 45.87,75.21 45.87,81.99 44.65,83.21 MC1.P$2 | v46.1,50.52 45.11,51.51 37.03,51.51 v35.28,49.76
LED1A  (via drill 0.3)
  Top 0.152: v35.89,61.04 36.12,60.81 36.12,49.3 25.6,38.79 18.44,38.79 17.3,39.93 13.49,39.93 R5.1 | v48.62,69.88 66.9,69.88 72.31,64.47 73,64.47 J6.1 73.08,64.47 75.06,66.45 80.92,66.45 JP6.1
  Bottom 0.152: v35.89,61.04 44.2,69.34 48.08,69.34 v48.62,69.88
MIDIINGND  (via drill 0.3)
  Top 0.305: v36.5,23.24 29.95,16.69 15.7,16.69 13.72,18.67 10.36,18.67 S2.1 | v54.48,51.13 54.48,57 v53.03,58.45
  Bottom 0.305: v36.5,23.24 40.01,26.75 41.38,26.75 45.49,30.86 45.49,44.2 46.94,45.64 46.94,49.53 48.46,51.05 54.41,51.05 v54.48,51.13 | v53.03,58.45 53.03,60.05 55.24,62.26 56.39,62.26 58.37,60.27 58.37,59.82 59.05,59.13 62.41,59.13 63.09,59.82 63.09,71.02 56.62,77.5 54.71,77.5 J7.1
MIDIINSND
  Top 0.152: OK1.1 33.15,31.24 33.15,36.65 29.87,39.93 D3.C 29.79,39.93 26.9,37.03 23.47,37.03 R3.1
MIDIINV+  (via drill 0.3)
  Top 0.508: v17.83,16.08 19.74,16.08 24.69,11.12 63.78,11.12 64.69,12.04 64.69,20.8 69.49,25.6 69.49,40.77 68.35,41.91 v68.35,58.6 | v69.27,68.28 69.27,77.5 J7.3
  Bottom 0.508: v17.83,16.08 12.72,21.18 10.36,21.18 S2.2 | v68.35,58.6 68.35,67.36 v69.27,68.28
MIRTN  (via drill 0.3)
  Top 0.152: v46.1,72.85 56.84,72.85 58.98,74.98 66.98,74.98 J7.5 | v35.36,61.65 35.36,56.62 35.81,56.16 35.81,49.45 26.36,40.01 22.25,40.01 D3.A
  Bottom 0.152: OK1.2 35.66,31.24 35.36,31.24 30.86,35.74 26.44,35.74 22.25,39.93 D3.A | v46.1,72.85 45.03,71.78 44.12,71.78 38.56,66.22 38.56,64.85 v35.36,61.65
MISND
  Bottom 0.152: R3.2 28.57,37.03 28.57,41.91 32.08,45.41 32.08,55.32 39.47,62.71 40.08,62.71 44.2,66.83 46.33,66.83 54.48,74.98 57,74.98 J7.4
MISO
  Top 0.152: J5.1 3.05,69.95 3.05,68.5 5.71,65.84 5.71,62.33 21.34,46.71 28.35,46.71 29.34,47.7 MC1.P$19
MNTR
  Top 0.152: SV2.33 25.22,12.34 26.44,12.34 35.81,21.72 40.16,21.72 41.99,23.55 41.99,35.89 39.17,38.71 39.17,57.84 36.73,60.27 36.73,61.49 30.25,67.97 29.41,67.97 MC1.P$27
MOSI
  Bottom 0.152: J5.4 2.97,73.76 2.97,73.61 2.21,72.85 2.21,69.72 2.74,69.19 4.5,69.19 5.71,70.41 6.33,70.41 11.35,65.38 11.35,54.25 7.7,50.6 7.7,47.78 11.73,43.74 20.5,43.74 28.19,36.04 36.8,36.04 39.85,39.09 39.85,40.46 44.58,45.19 MC1.P$17
RST  (via drill 0.3)
  Top 0.152: 32.65,58.33 32.69,58.37 33.15,58.37 35.28,56.24 v35.28,55.93 | 32.65,58.33 29.72,55.4 29.41,55.4 MC1.P$13 | v25.6,72.31 26.52,71.4 26.52,66.6 28.88,64.24 29.79,64.24 32.61,61.42 32.61,58.37 32.65,58.33
  Bottom 0.152: v35.28,55.93 44.04,55.93 44.58,55.4 MC1.P$22 | 19.47,75.93 25.6,82.07 34.59,82.07 39.24,86.72 S1.2 | 19.47,75.93 16.69,73.15 13.34,73.15 11.43,75.06 3.05,75.06 J5.5 | v25.6,72.31 23.09,72.31 19.47,75.93
RX  (via drill 0.3)
  Top 0.152: v38.41,71.78 38.41,64.08 40.84,61.65 45.11,61.65 46.18,60.58 46.18,54.33 46.14,54.29 | 46.14,54.29 44.65,52.81 MC1.P$14 | 46.14,54.29 46.63,53.8 47.85,53.8 57,44.65 57,43.28 60.5,39.78 60.5,36.27 63.48,33.3 63.48,29.87 64.08,29.26 64.08,24.84 63.55,24.31 62.71,24.31 61.8,25.22 60.66,25.22 SV1.12
  Bottom 0.152: v38.41,71.78 35.97,69.34 28.96,69.34 28.65,69.04 25.6,69.04 RN3.5 | OK1.7 35.66,38.86 35.66,48.62 34.75,49.53 34.75,49.99 37.49,52.73 44.58,52.73 MC1.P$14
SCK
  Bottom 0.152: J5.3 3.05,72.47 5.49,72.47 23.47,54.48 24.31,54.48 28.12,50.67 28.12,46.41 29.34,45.19 MC1.P$18
SCL  (via drill 0.3)
  Top 0.152: v61.19,26.75 60.66,26.75 59.59,25.68 59.59,25.45 58.45,24.31 55.09,24.31 54.18,25.22 53.03,25.22 SV1.6 | v77.42,40.77 v73.76,37.11 73.76,37.19 68.89,42.06 68.89,58.83 62.48,65.23 61.27,65.23 59.51,66.98 Q4.1 | 23.47,61.27 23.77,60.96 JP2.4 23.47,61.27 | 23.47,61.27 17.07,67.67 17.07,70.03 17.6,70.56 18.36,70.56 19.89,69.04 20.5,69.04 RN3.3 | 23.47,61.27 v19.66,57.45 | v58.9,69.34 64.85,69.34 70.79,63.4 80.85,63.4 83.21,65.76 83.21,66.67 84.96,68.43 84.96,68.96 J1.3 | v39.7,63.55 44.04,63.55 44.58,63.02 MC1.P$10
  Bottom 0.152: Q1.3 84.89,37.95 83.9,37.95 81.99,36.04 R101.1 82.07,36.2 77.46,40.8 | 77.46,40.8 77.04,41.22 77.04,43.28 JMP3.3 | v61.19,26.75 62.56,28.12 64.77,28.12 v73.76,37.11 | v77.42,40.77 77.46,40.8 | v19.66,57.45 11.28,49.07 DISP2.3 | 58.9,66.98 57.45,66.98 53.95,63.48 45.11,63.48 44.65,63.02 MC1.P$10 | 58.9,66.98 59.44,66.98 Q4.1 58.9,66.98 | 58.9,66.98 v58.9,69.34 | v39.7,63.55 39.4,63.55 32.46,56.62 28.88,56.62 24.61,60.88 23.85,60.88 JP2.4
SCL3V  (via drill 0.3)
  Top 0.152: v82.22,45.57 82.22,40.77 v83.06,39.93
  Bottom 0.152: Q1.2 86.94,37.11 85.65,38.41 85.65,38.48 84.2,39.93 v83.06,39.93 81.99,39.93 R102.1 | v82.22,45.57 81.15,46.63 77.04,46.63 JMP3.1
SCL3V/5V
  Bottom 0.152: JMP3.2 77.04,45.03 84.51,45.03 88.92,49.45 DISP1.8
SDA  (via drill 0.3)
  Top 0.152: J1.2 85.04,70.94 85.04,70.48 86.03,69.49 86.03,52.5 v83.06,49.53 81.69,48.16 81.69,44.42 80.62,43.36 v75.74,43.36 72.54,43.36 70.56,41.38 70.1,41.38 69.42,42.06 v69.42,46.33 | 20.38,66.86 23.77,63.48 JP2.5 | 20.38,66.86 18.29,68.96 17.98,68.96 RN3.2 | 20.38,66.86 21.41,67.89 21.41,70.03 20.57,70.87 17.45,70.87 16.76,70.18 v16.76,59.21 17.14,59.21 21.87,54.48 28.5,54.48 28.88,54.1 32.69,54.1 v33.68,55.09 | v49.91,30.86 55.47,25.3 SV1.8 | v46.71,38.48 46.71,41.38 43.36,44.73 43.36,51.59 | 43.36,51.59 43.36,55.78 44.2,56.62 45.11,56.62 45.87,57.38 45.87,59.13 44.65,60.35 MC1.P$11 | v49.23,51.66 45.19,51.66 45.11,51.59 43.36,51.59
  Bottom 0.152: Q2.3 84.89,51.97 83.9,51.97 81.99,50.06 R103.1 82.3,50.29 v83.06,49.53 | v75.74,43.36 74.52,43.36 JMP2.3 | v16.76,59.21 8.76,51.21 8.76,49.07 DISP2.4 | v49.91,30.86 49.91,32.69 46.71,35.89 v46.71,38.48 | v33.68,55.09 38.94,60.35 44.58,60.35 MC1.P$11 | v69.42,46.33 64.08,51.66 v49.23,51.66
SDA3V
  Bottom 0.152: Q2.2 86.94,51.05 85.65,52.35 85.65,52.43 84.12,53.95 81.99,53.95 R104.1 81.92,53.95 79.1,51.13 79.1,50.75 78.72,50.37 78.49,50.37 74.83,46.71 74.52,46.71 JMP2.1
SDA3V/5V  (via drill 0.3)
  Top 0.152: v87.71,49 87.94,49 88.92,48.01 DISP1.7
  Bottom 0.152: v87.71,49 87.63,48.92 77.5,48.92 75.97,47.4 75.97,46.41 75.36,45.8 75.29,45.8 74.52,45.03 JMP2.2
THS
  Top 0.152: MC1.P$26 29.41,65.46 32.31,65.46 36.42,61.34 36.42,49.15 25.6,38.33 17.83,38.33 13.03,33.53 13.03,31.47 J10.2
  Bottom 0.152: RN3.4 23.09,68.96 23.7,68.96 27.13,65.53 29.34,65.53 MC1.P$26 | SV1.9 57.99,22.71 57.99,14.25 56.62,12.88 56.62,11.89 55.7,10.97 35.28,10.97 33.76,12.5 33.76,12.65 25.15,21.26 23.16,21.26 18.14,26.29 13.34,26.29 13.03,26.59 13.03,31.39 J10.2
TX
  Top 0.152: SV1.14 63.17,25.3 63.17,32.84 60.81,35.2 59.05,35.2 57,37.26 57,37.87 44.65,50.22 MC1.P$15
V+  (via drill 0.3)
  Top 1.016: 18.82,17.98 28.5,17.98 34.44,23.93 F1.1 | 18.82,17.98 15.62,17.98 13.49,20.12 13.49,20.65 11.58,22.55 9.07,22.55 7.77,21.26 2.74,21.26 S2.3 | v6.02,69.65 12.8,69.65 19.13,75.97 22.48,75.97 J0.3 | v18.82,17.53 18.82,17.98
  Bottom 1.016: 76.47,18.63 81.23,13.87 81.23,13.79 81.92,13.11 83.06,13.11 85.8,15.85 85.8,20.65 87.63,22.48 87.94,22.48 JP5.3 | 76.47,18.63 73.3,21.79 73.3,22.71 JP1.1 | v6.02,69.65 6.02,65.46 4.19,63.63 4.19,22.71 2.74,21.26 S2.3 | 76.47,18.63 69.65,11.81 69.65,9.91 66.83,7.09 24.16,7.09 18.82,12.42 v18.82,17.53
VCC  (via drill 0.3)
  Top 0.508: C8.1 73.08,69.72 76.43,69.72 C9.1 | 80.09,51.66 80.09,56.92 84.96,61.8 84.96,65 J1.5 | 80.09,51.66 v80.09,51.36 | JP5.2 87.94,19.96 84.51,19.96 82.98,18.44 82.07,18.44 79.55,20.95 79.55,23.24 78.87,23.93 77.04,23.93 75.89,22.78 JP1.3 75.59,22.86 74.83,22.86 73.76,23.93 v71.25,23.93 | 80.09,51.66 78.18,51.66 73.23,46.71 v73.23,44.12 | J5.2 3.05,71.25 5.56,68.73 15.16,68.73 15.39,68.96 RN3.1 15.24,68.5 15.24,59.66 21.57,53.34 23.77,53.34 JP2.1 | C6.1 44.04,33.68 44.04,29.11 47.85,25.3 SV1.2 | v38.25,33.76 33.22,38.79 OK1.8 | J2.2 6.02,33.07 6.02,33.3 12.34,39.62 12.34,47.62 13.72,49 DISP2.2 | v65.91,23.93 58.67,16.69 v52.58,16.69
  Bottom 0.508: v80.09,51.36 80.09,50.06 R103.2 | C9.1 77.8,69.72 79.86,67.67 82.37,67.67 84.96,65.08 J1.5 | JP1.3 75.89,22.78 75.89,23.62 77.19,24.92 77.19,33.3 79.7,35.81 R101.2 80.01,36.04 79.78,36.04 72.54,43.28 72.01,43.28 JMP1.3 72.62,43.51 v73.23,44.12 | MC1.P$23 29.34,57.91 29.34,58.52 25.15,62.71 25.15,64.01 21.95,67.21 17.22,67.21 15.47,68.96 RN3.1 | C6.1 43.97,33.76 v38.25,33.76 38.18,33.53 38.18,32.61 36.8,31.24 36.8,29.41 36.12,28.73 35.36,28.73 34.29,29.79 34.29,31.62 33.6,32.31 15.85,32.31 15.16,31.62 J10.3 14.94,31.47 14.71,31.47 13.18,32.99 6.02,32.99 J2.2 | DISP2.2 13.79,49.07 13.95,49.07 18.14,53.26 23.77,53.26 JP2.1 | v65.91,23.93 v71.25,23.93 | v52.58,16.69 52.58,18.97 49.07,22.48 49.07,24.08 47.93,25.22 SV1.2
VCC/2  (via drill 0.3)
  Top 1.016: v51.28,32.84 53.11,31.01 55.78,31.01 D10.C 56.24,30.71 56.92,30.71 59.89,27.74 61.57,27.74 v62.41,26.9 | v50.22,33.91 53.26,36.96 55.78,36.96 D9.C | D5.C 55.85,61.04 55.85,66.98 D4.C | D7.C 55.85,49.07 55.85,54.94 D6.C 55.63,55.47 v55.63,57.3 | v55.85,40.69 55.85,42.98 D8.C | SV2.32 27.74,9.75 30.25,9.75 SV2.30 30.79,9.75 32.77,9.75 SV2.28 33.3,9.75 35.28,9.75 SV2.26 35.81,9.75 37.87,9.75 SV2.24 38.41,9.75 40.39,9.75 SV2.22 40.92,9.75 42.9,9.75 SV2.20 43.43,9.75 45.49,9.75 SV2.18 46.02,9.75 48.01,9.75 SV2.16 48.54,9.75 50.52,9.75 SV2.14 51.05,9.75 53.11,9.75 SV2.12 53.65,9.75 55.63,9.75 SV2.10 56.16,9.75 58.14,9.75 SV2.8 58.67,9.75 60.73,9.75 SV2.6 61.27,9.75 63.25,9.75 SV2.4 63.78,9.75 65.76,9.75 SV2.2 66.14,10.13 78.33,22.33 78.33,22.71 JP1.5
  Bottom 1.016: v50.22,33.91 v51.28,32.84 | D8.C 55.85,43.05 55.85,49 D7.C | v55.63,57.3 55.78,57.45 55.78,60.96 D5.C | v55.85,40.69 55.85,37.03 D9.C | v62.41,26.9 63.48,26.9 64.92,25.45 64.92,19.81 67.21,17.53 67.21,11.12 65.84,9.75 SV2.2
VDD  (via drill 0.3)
  Top 0.508: v81,44.5 81,48.39 v78.49,50.9
  Bottom 0.508: 81.08,41.22 83.59,41.22 85.8,39.01 86.94,39.01 Q1.1 | 81.08,41.22 80.09,40.23 80.09,40.01 R102.2 | 81.15,55.24 83.52,55.24 85.8,52.96 86.94,52.96 Q2.1 | 81.15,55.24 80.09,54.18 80.09,54.03 R104.2 79.86,53.87 79.63,53.87 77.57,51.82 | 77.57,51.82 72.47,46.71 JMP1.1 | MC1.P$33 29.41,83.29 29.57,83.29 34.21,87.94 49.3,87.94 68.2,69.04 72.16,69.04 75.51,65.68 77.5,65.68 81,62.18 81,55.4 81.15,55.24 | v81,44.5 81,41.45 81.08,41.22 | 77.57,51.82 v78.49,50.9
VDD/VCC  (via drill 0.3)
  Top 0.508: v85.95,49.45 85.95,48.01 88.92,45.03 DISP1.5 | v81.76,59.66 81.61,59.66 79.78,61.49 C11.1
  Bottom 0.508: v85.95,49.45 87.1,49.45 88.62,50.98 88.92,50.98 DISP1.9 88.54,51.21 88.54,52.88 v81.76,59.66 | C11.1 79.7,61.49 70.79,52.58 70.79,45.87 71.63,45.03 71.93,45.03 JMP1.2 71.48,44.88 70.79,44.2 70.79,42.52 74.52,38.79 74.52,22.33 75.36,21.49 75.44,21.49 82.45,14.48 C13.1
VIN  (via drill 0.3)
  Top 1.016: v67.59,29.87 67.59,30.79 65.15,33.22 v64.69,33.22 | v61.72,33.22 60.5,33.22 v59.28,34.44 | v50.44,35.81 49.3,35.81 48.84,35.36 47.55,35.36 41.68,41.22 v41.68,53.49 | v33.15,53.49 29.95,50.29 29.41,50.29 MC1.P$20
  Bottom 1.016: v67.59,29.87 72.16,25.3 73.23,25.3 JP1.2 | v61.72,33.22 v64.69,33.22 | v59.28,34.44 51.82,34.44 v50.44,35.81 | v33.15,53.49 v41.68,53.49
VIN0
  Top 1.016: F1.2 39.47,24 37.95,24 33.98,27.96 33.22,27.96 D1.C | C2.1 24.77,25.98 24.77,22.55 C1.1 24.31,22.17 21.34,19.2 16.92,19.2 15.01,21.11 15.01,21.41 V1.IN
  Bottom 1.016: D1.C 33.15,28.04 31.17,28.04 27.81,31.39 24.23,31.39 22.17,29.34 22.17,24.38 24,22.55 24.69,22.55 C1.1
VOUT  (via drill 0.3)
  Top 1.016: JP1.6 78.33,25.3 75.89,25.3 JP1.4 75.29,25.3 73.84,26.75 72.69,26.75 v68.43,22.48 | C3.1 24.77,30.02 24.77,33.98 C4.1 | v23.39,24.84 20.04,21.49 V1.OUT
  Bottom 1.016: v23.39,24.84 23.39,28.65 24.69,29.95 C3.1 25.15,29.72 26.21,28.65 27.58,28.65 29.87,26.36 35.05,26.36 36.65,27.96 40.77,27.96 D1.A | J3.2 6.02,42.98 13.64,42.98 18.29,38.33 20.19,38.33 24.46,34.06 24.69,34.06 C4.1 | v68.43,22.48 68.43,10.36 66.37,8.31 24.61,8.31 20.04,12.88 20.04,21.41 V1.OUT

### Text on the board
tNames: DC12V | USB | IN | G | RST | A | MKR | R | O | LED | C | SPI | 0 | GND | Pineapple Vii | 2.0.0-X | L0 | V | SDA | I | 1 | SCL | 2 | 103 | 104 | 1 | 2-472 | I2C | THS* | D7 | 0 | GPIO | N | 3 | 03PWM | Vcc | N | SD | L1 | G | L0 | 104 | SC | Akizuki / AQM0802A-RN-GBW | 05PWM | SparkFun / Real Time Clock / Module (12708) | NC | G | 5V | 06PWM | 9 | RTC | PWRSEL | 09PWM | SD | SC | 5V | G | DISP | Dual Regulator | Adafruit SSD1306 | Vout | Arduino Micro | Vout | LED | Single Regulator | GND | 10PWM | 102 | MC1 | Arduino Only | 1 | G1 | GPIO | 102 | 221 | TLP2630 | G0 | 11PWM | 104 | 47u | Direct 5V | Vcc | GND | G | TH* | V | 13PWM | PWRSEL | DS18B20+ | REG | Vin | Vout | Vout | MIDI Phantom | 12V | 1u | 10u | 104 | V+ | Vcc | Vcc/2 | Vcc | TestPort II | 4-M2.3 | 1u | LightDrive (1-7) | Designed for / Takachi / PF10-4-10 | GND
bNames: Vdd | V+ | SPI | I2C/THS*/RX | MKR | THS* | GPIO | Vcc | 4-103 | 4 | 5 | Vin | 3.3V | Relay-N.O. | Relay-Common | 2-BSS138 | Vcc/2 | 5V | RLY | GPIO | Relay-N.C. | MIDI IN | Vcc | THS* | V+ | Vin | Vo | Vo | Vout | V+ | Vcc | V/2 | PWR | V+ | Bridge here to connect Vcc/2 and GND